# EAGLE design ADDINBRD2_V1 (EAGLE 7.7.0)

## Sheet 1 of 2
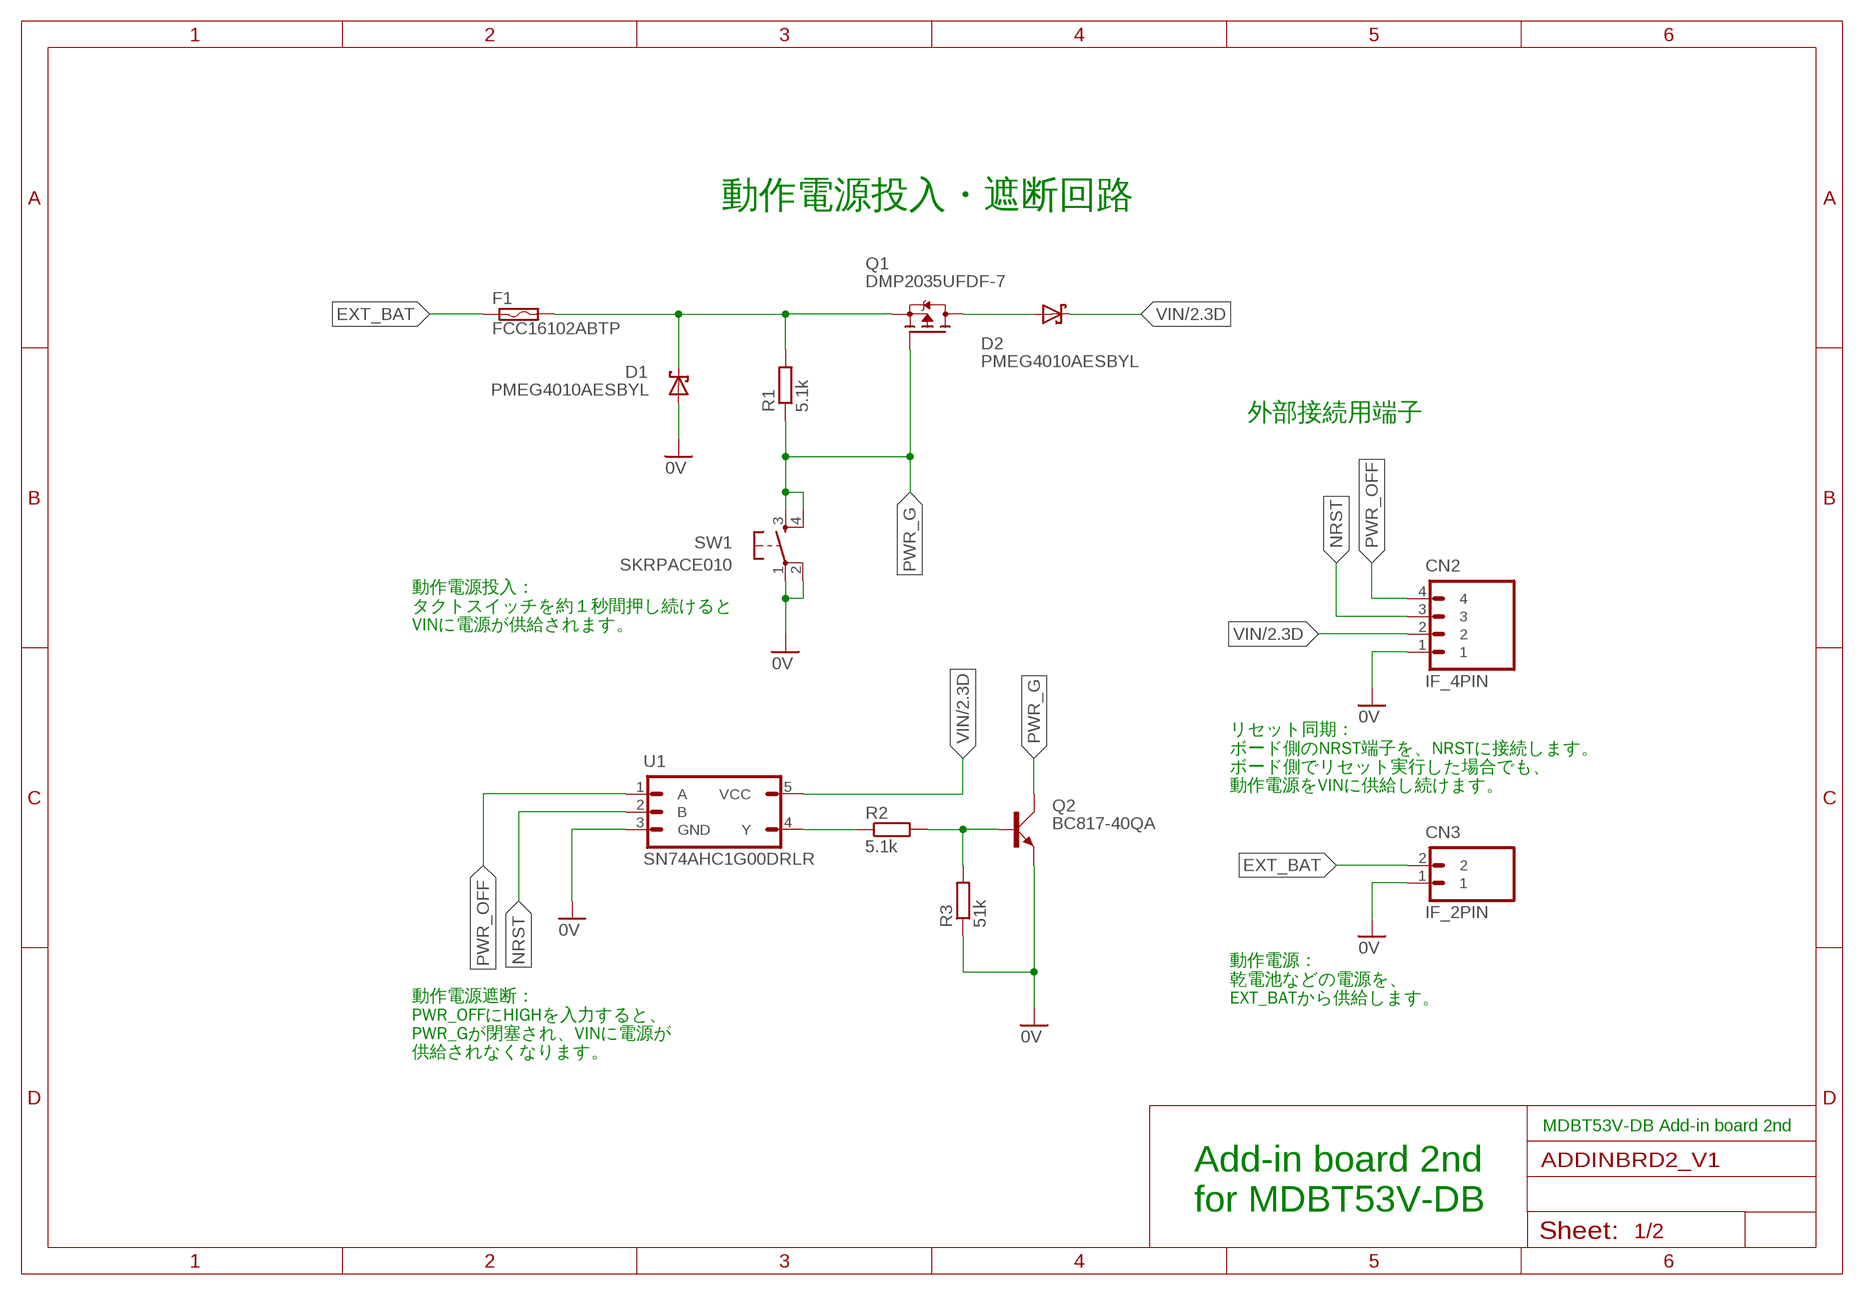
[diagram p0: schematic, sheet 1]

### Parts
CN2  IF_4PIN  [HEADER_4PIN]
CN3  IF_2PIN  [HEADER_2PIN]
D1  PMEG4010AESBYL  [DSN1006-2]
D2  PMEG4010AESBYL  [DSN1006-2]
F1  FCC16102ABTP  [FCC16]
Q1  DMP2035UFDF-7  [U-DFN2020-6]
Q2  BC817-40QA  [DFN1010D-3]
R1  5.1k  CRCW04025K10FKEDC  [R0402N]
R2  5.1k  CRCW04025K10FKEDC  [R0402N]
R3  51k  CRCW040251K0FKEDC  [R0402N]
SW1  SKRPACE010  [SKRPACE010]
U1  SN74AHC1G00DRLR  [DRL0005A]

### Nets
0V: CN2.1 CN3.1 D1.1(A) Q2.2(E) R3.1 SW1.1(P) SW1.2(P1) U1.3(GND) ; also sheet 2
EXT_BAT: CN3.2 F1.1
N$1: D1.2(C) F1.2 Q1.4(S) Q1.EXP2(S) R1.2
N$2: D2.1(A) Q1.1(D) Q1.2(D) Q1.5(D) Q1.6(D) Q1.EXP(D)
N$3: R2.1 U1.4(Y)
N$5: Q2.1(B) R2.2 R3.2
NRST: CN2.3 U1.2(B)
PWR_G: Q1.3(G) Q2.3(C) R1.1 SW1.3(S) SW1.4(S1)
PWR_OFF: CN2.4 U1.1(A)
VIN: CN2.2 D2.2(C) U1.5(VCC) ; also sheet 2

### Notes on the sheet
- 動作電源投入・遮断回路
- 外部接続用端子
- 動作電源投入：
  タクトスイッチを約１秒間押し続けると
  VINに電源が供給されます。
- リセット同期：
  ボード側のNRST端子を、NRSTに接続します。
  ボード側でリセット実行した場合でも、
  動作電源をVINに供給し続けます。
- 動作電源：
  乾電池などの電源を、
  EXT_BATから供給します。
- 動作電源遮断：
  PWR_OFFにHIGHを入力すると、
  PWR_Gが閉塞され、VINに電源が
  供給されなくなります。
- MDBT53V-DB Add-in board 2nd
- Add-in board 2nd
  for MDBT53V-DB

## Sheet 2 of 2
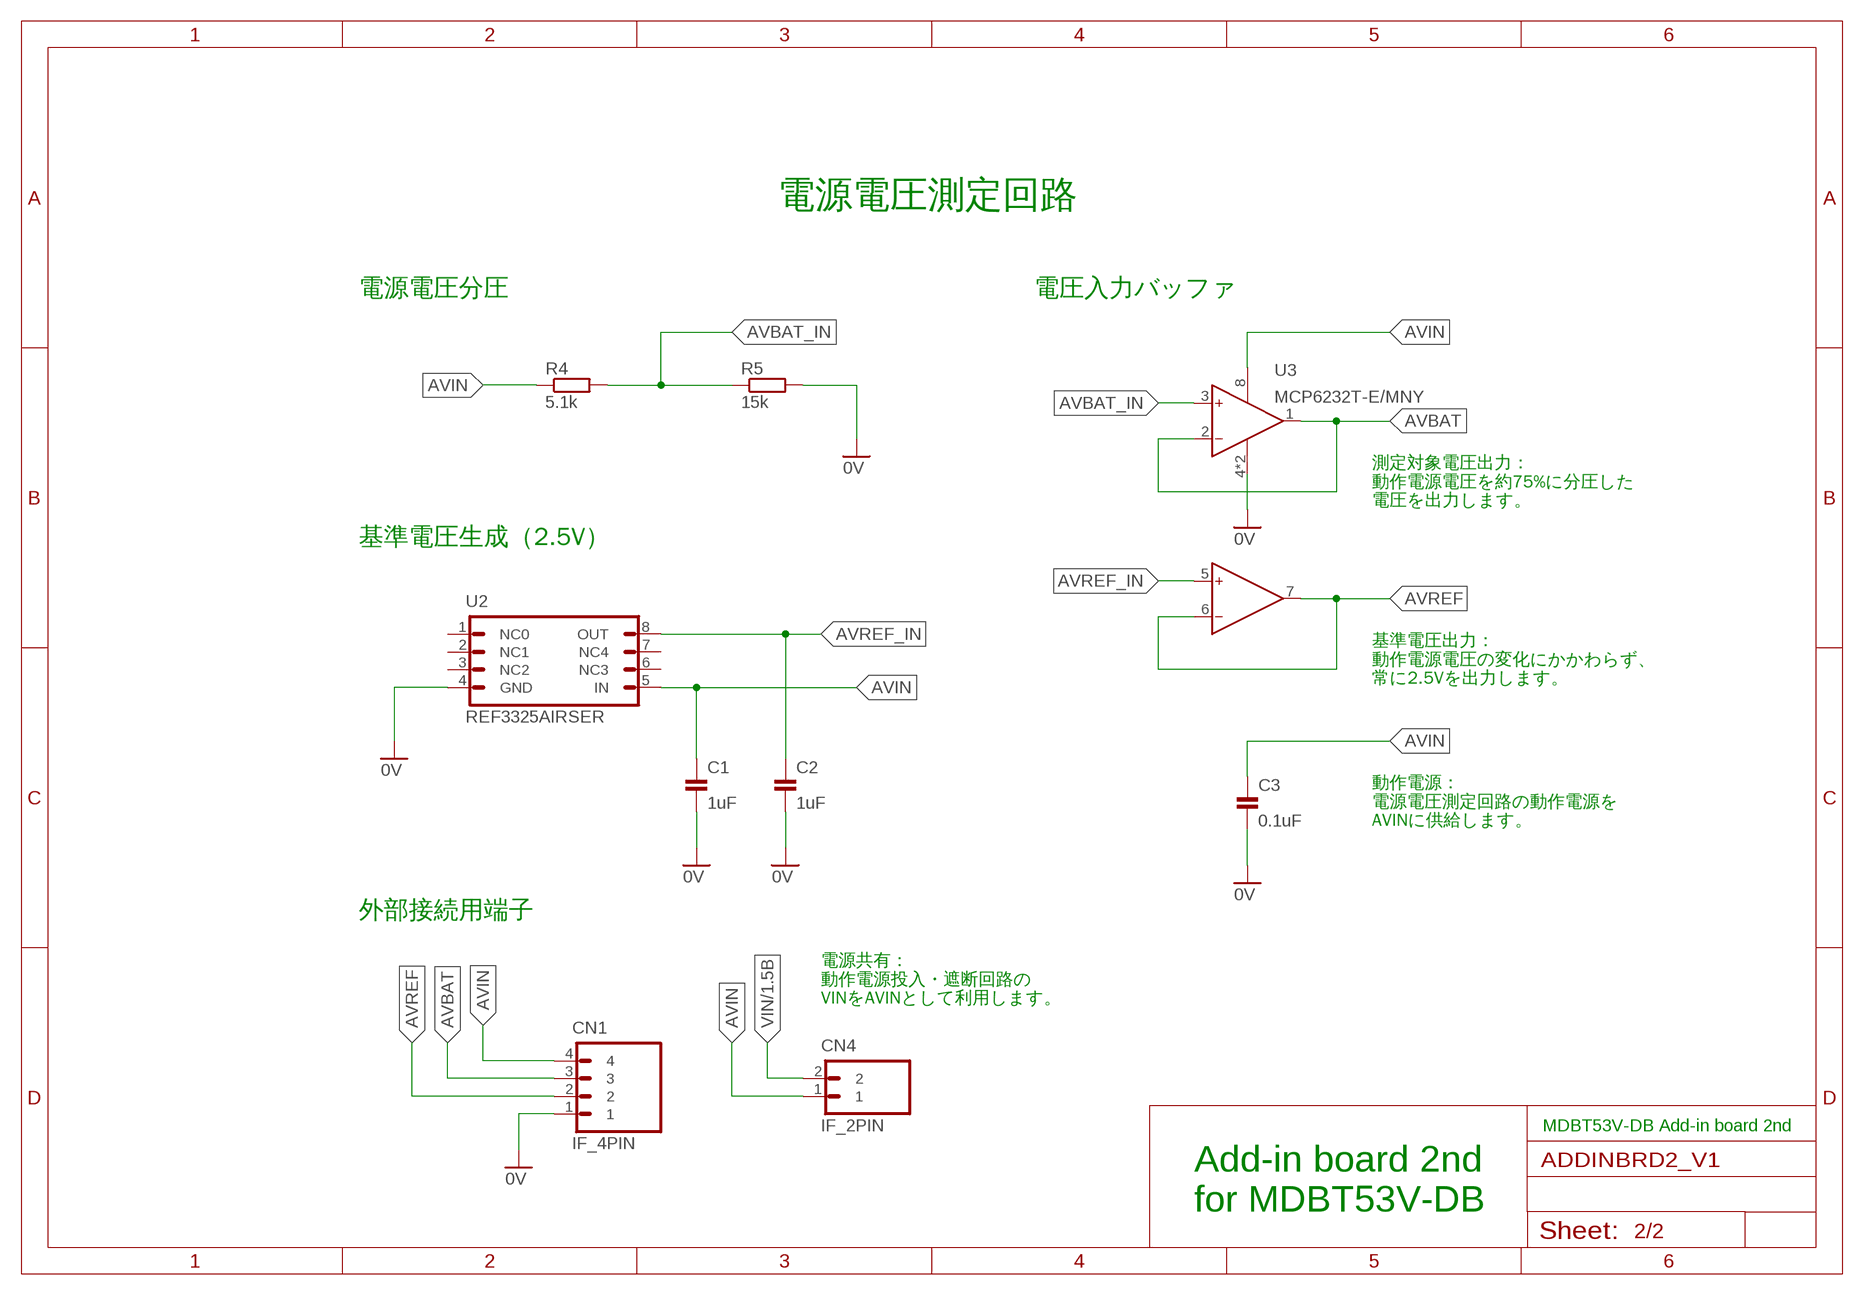
[diagram p1: schematic, sheet 2]

### Parts
C1  1uF  TMK105AC6105KV-F  [C0402]
C2  1uF  TMK105AC6105KV-F  [C0402]
C3  0.1uF  UMK105B7104KV-FR  [C0402]
CN1  IF_4PIN  [HEADER_4PIN]
CN4  IF_2PIN  [HEADER_2PIN]
R4  5.1k  ERA-2APB512X  [R0402N]
R5  15k  ERA-2APB153X  [R0402N]
U2  REF3325AIRSER  [RSE0008A]
U3  MCP6232T-E/MNY  [TDFN-2X3]

### Nets
0V: C1.2 C2.2 C3.2 CN1.1 R5.2 U2.4(GND) U3.4(VSS) U3.9(VSS) ; also sheet 1
AVBAT: CN1.3 U3.1(VOUTA) U3.2(VINA-)
AVBAT_IN: R4.2 R5.1 U3.3(VINA+)
AVIN: C1.1 C3.1 CN1.4 CN4.1 R4.1 U2.5(IN) U3.8(VDD)
AVREF: CN1.2 U3.6(VINB-) U3.7(VOUTB)
AVREF_IN: C2.1 U2.8(OUT) U3.5(VINB+)
VIN: CN4.2 ; also sheet 1
Unconnected: U2.1(NC0) U2.2(NC1) U2.3(NC2) U2.6(NC3) U2.7(NC4)

### Notes on the sheet
- 電源電圧測定回路
- 電源電圧分圧 | 電圧入力バッファ
- 測定対象電圧出力：
  動作電源電圧を約75%に分圧した
  電圧を出力します。
- 基準電圧生成（2.5V）
- 基準電圧出力：
  動作電源電圧の変化にかかわらず、
  常に2.5Vを出力します。
- 動作電源：
  電源電圧測定回路の動作電源を
  AVINに供給します。
- 外部接続用端子
- 電源共有：
  動作電源投入・遮断回路の
  VINをAVINとして利用します。
- MDBT53V-DB Add-in board 2nd
- Add-in board 2nd
  for MDBT53V-DB

## Library data of the parts
C1 C2 = SMDs:TMK105AC6: MLCC TAIYO YUDEN Multilayer Ceramic Capacitors
C3 = SMDs:UMK105B7: MLCC TAIYO YUDEN Multilayer Ceramic Capacitors
CN1 CN2 = Connectors:IF_4PIN: 4-pin インターフェース
CN3 CN4 = Connectors:IF_2PIN: 2-pin インターフェース
D1 D2 = SMDs:PMEG4010: Schottky Diode If - Forward Current: 1 A Vf - Forward Voltage: 435 mV Vr - Reverse Voltage: 40 V Ir - Reverse Current: 325 uA Minimum Operating Temperature: from -55C to +150C
F1 = SMDs:FCC16: Surface Mount Fuse 0603 Current Rating: 1 A Voltage Rating DC: 36 VDC Operating Temperature: from -55C to +125C Resistance: 130 mOhms
Q1 = SMDs:DMP2035: P-CHANNEL ENHANCEMENT MODE MOSFET Vds - Drain-Source Breakdown Voltage: 20 V Id - Continuous Drain Current: 6.9 A Rds On - Drain-Source Resistance: 120 mOhms Vgs th - Gate-Source Threshold Voltage: 1 V Operating Temperature: from - 55 C to + 150 C
Q2 = SMDs:BC817: NPN general-purpose transistor
R1-R3 = SMDs:CRCW0402: Chip resistor Vishay / Dale Thick Film Resistors
R4 R5 = SMDs:ERA-2A: Chip resistor Panasonic Thin Film Resistors
SW1 = Parts:SKRPACE010: 表面実装用タクトスイッチ ４．２×３．２ｍｍ小型重作動力タイプ ・作動力：２．５５Ｎ ・操作方向：垂直 ・移動量：０．２ｍｍ ・動作寿命：５０，０００ｃｙｃｌｅｓ （５ｍＡ ５ＶＤＣ） ・初期接触抵抗：最大５００ｍΩ
U1 = ICs:SN74AHC1G00: Single 2-Input Positive-NAND Gate Texas Instruments
U2 = ICs:REF33: Voltage Reference Output Voltage: 2.5 V Initial Accuracy: 0.15 % Temperature Coefficient: 30 PPM / C Series VREF - Input Voltage - Max: 5.5 V Operating Temperature: from- 40 C to + 125 C
U3 = ICs:MCP6232: Operational Amplifier Microchip 2 Channel Rail to Rail Operational Amplifier

## Board
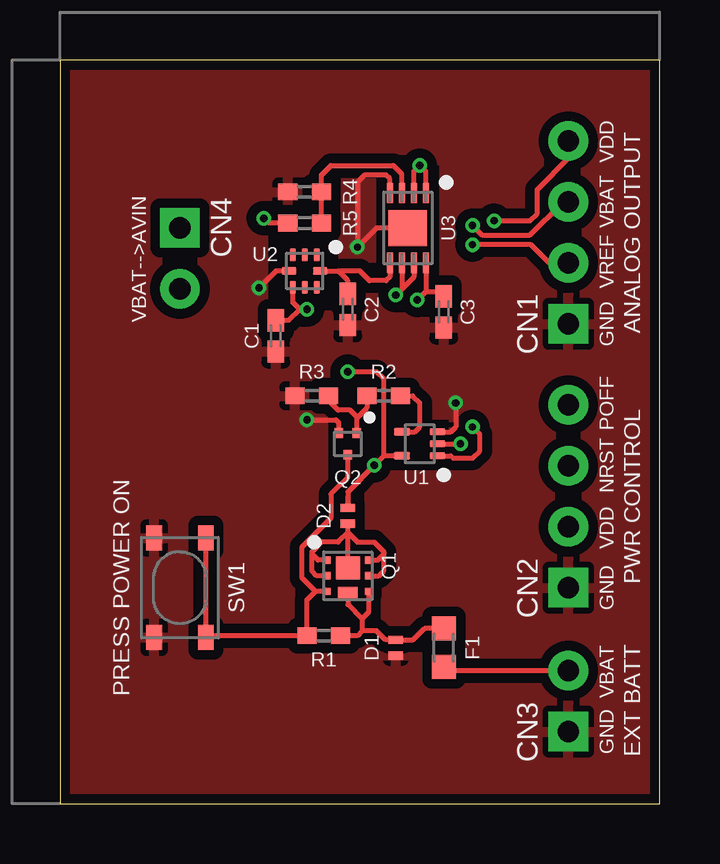
[diagram p2: board, top side]
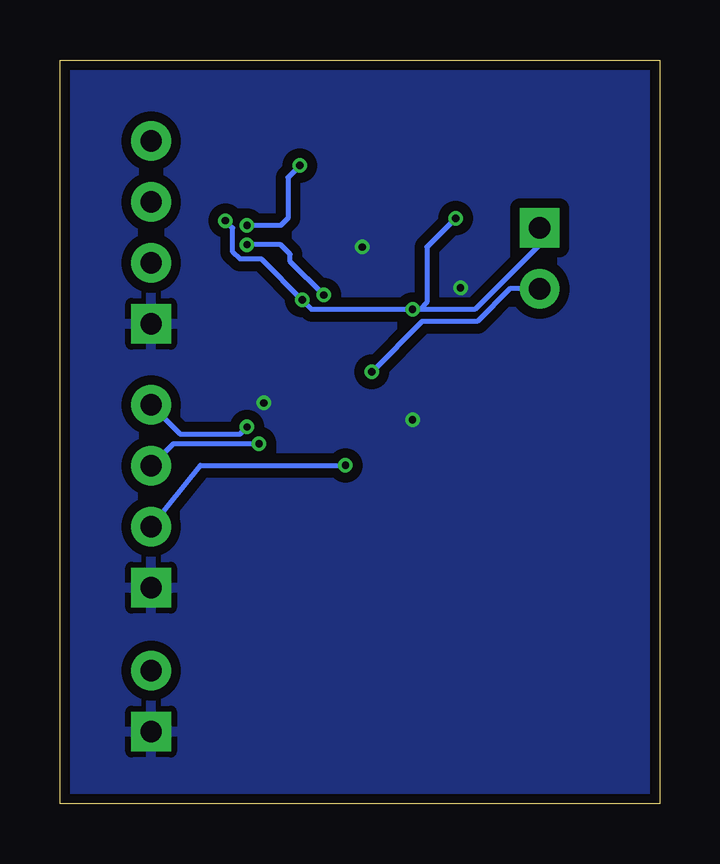
[diagram p3: board, bottom side, seen from below]

Size 25 x 31 mm. Coordinates in mm from the lower left corner, seen from the top.
Outline: 0,0 25,0 25,31 0,31 0,0
Copper layers (1*16): Top 0.035mm / dielectric 1.5mm / Bottom 0.035mm
Design rules "SeeedStudio_2layer_DRU_no_angle_20140221 *": minimum track width 6mil, minimum drill 0.3mm, track to track 6mil, track to pad 6mil, pad to pad 6mil, via to via 6mil, smd to smd 0mil, copper to edge 10mil, drill to drill 10mil, minimum pad ring 10mil, minimum via ring 6mil, stop-mask expansion 2mil, vias tented up to drill 100mil, thermal gap 10mil

### Footprints (pad centres in the part's own frame; a part is rotated, then mirrored left to right if it is on the bottom)
C0402 = smd 0.925 x 0.7: 1 -0.65,0; 2 0.65,0
HEADER_4PIN = drill 0.889 pad 1.651 square: 1 0,0 | drill 0.889 pad 1.651: 2 2.54,0; 3 5.08,0; 4 7.62,0
HEADER_2PIN = drill 0.889 pad 1.651 square: 1 0,0 | drill 0.889 pad 1.651: 2 2.54,0
DSN1006-2 = smd 0.35 x 0.6: 1 -0.325,0; 2 0.325,0
FCC16 = smd 1 x 1: 1 -0.8,0; 2 0.8,0
U-DFN2020-6 = smd 0.3 x 0.275: 1 -0.65,-0.863; 2 0,-0.863; 3 0.65,-0.863; 4 0.65,0.863; 5 0,0.863; 6 -0.65,0.863 | smd 0.95 x 1: EXP -0.325,0 | smd 0.48 x 0.8: EXP2 0.7,0
DFN1010D-3 = smd 0.35 x 0.4: 1 0.375,0.45; 2 -0.375,0.45; 3 0,-0.45
R0402N = smd 0.8 x 0.7: 1 -0.7,0; 2 0.7,0
SKRPACE010 = smd 1.05 x 0.65: 1 -2.075,1.075; 2 2.075,1.075; 3 -2.075,-1.075; 4 2.075,-1.075
DRL0005A = smd 0.67 x 0.28: 1 -0.74,0.5; 2 -0.74,0; 3 -0.74,-0.5 | smd 0.67 x 0.3: 4 0.74,-0.5; 5 0.74,0.5
RSE0008A = smd 0.55 x 0.25: 1 -0.675,0.5; 2 -0.675,0; 3 -0.675,-0.5; 5 0.675,-0.5; 6 0.675,0; 7 0.675,0.5 | smd 0.3 x 0.6: 4 0,-0.65; 8 0,0.65
TDFN-2X3 = smd 0.25 x 0.85: 1 -0.75,-1.45; 2 -0.25,-1.45; 3 0.25,-1.45; 4 0.75,-1.45; 5 0.75,1.45; 6 0.25,1.45; 7 -0.25,1.45; 8 -0.75,1.45 | smd 1.6 x 1.5: 9 0,0

### Placement (x,y rotation side)
C1  9,19.5 270 top
C2  12,20.6 270 top
C3  16,20.5 270 top
CN1  21.2,20 90 top
CN2  21.2,9 90 top
CN3  21.2,3 90 top
CN4  5,24 270 top
D1  14,6.5 90 top
D2  12,12 90 top
F1  16,6.5 90 top
Q1  12,9.5 270 top
Q2  12,15 0 top
R1  11,7 0 top
R2  13.5,17 180 top
R3  10.5,17 0 top
R4  10.2,24.2 0 top
R5  10.2,25.5 180 top
SW1  5,9 90 top
U1  15,15 180 top
U2  10.2,22.2 270 top
U3  14.5,24 180 top

### Tracks (layer width: path | path; a pad name or v marks a point on that pad's centre or on a via)
0V  (via drill 0.3)
  Top 0.203: U1.3 16.3,15.5 16.5,15.7 v16.5,16.7 | Q2.2 11.62,15.88 11.5,16 v10.3,16 | U2.4 9,22.2 v8.3,21.5 | U3.9 13.2,24 v12.4,23.2 12.4,25.9 12.7,26.2 13.6,26.2 13.75,26.05 U3.4
  pour Top (isolate 0.406, rank 3): -0.5,-0.5 25.5,-0.5 25.5,31.5 -0.5,31.5
  pour Bottom (isolate 0.406, rank 3): -1,-1 26,-1 26,32 -1,32
AVBAT  (via drill 0.3)
  Top 0.203: U3.1 15.25,26.35 v15,26.6 14.75,26.35 U3.2 | v17.2,24.1 17.6,23.7 19.6,23.7 20.98,25.08 CN1.3
  Bottom 0.203: v15,26.6 15.5,26.1 15.5,24.4 15.8,24.1 v17.2,24.1
AVBAT_IN
  Top 0.203: R4.2 R5.1 10.9,26.2 11.3,26.6 13.9,26.6 14.25,26.25 U3.3
AVIN  (via drill 0.3)
  Top 0.203: 10,20.6 9.7,20.9 U2.5 | v10.3,20.6 10,20.6 | 10,20.6 9.55,20.15 C1.1 | R4.1 8.7,24.2 v8.5,24.4 | U3.8 15.25,21.35 | 15.25,21.35 v14.9,21 | 15.25,21.35 15.8,21.35 C3.1 | CN1.4 21.2,26.9 19.9,25.6 19.9,24.6 19.6,24.3 v18.1,24.3
  Bottom 0.203: CN4.1 5,23.3 7.7,20.6 v10.3,20.6 | v8.5,24.4 9.7,23.2 9.7,20.9 10,20.6 v10.3,20.6 | v10.3,20.6 14.5,20.6 v14.9,21 16.6,22.7 17.5,22.7 17.8,23 17.8,24 v18.1,24.3
AVREF  (via drill 0.3)
  Top 0.203: U3.6 14.25,21.45 v14,21.2 14.75,21.95 U3.7 | v17.2,23.3 19.64,23.3 20.4,22.54 CN1.2
  Bottom 0.203: v14,21.2 15.4,22.6 15.4,22.9 15.8,23.3 v17.2,23.3
AVREF_IN
  Top 0.203: U2.8 11.6,22.2 11.65,22.15 | C2.1 12,21.8 11.65,22.15 | U3.5 13.75,21.95 13.6,21.8 12.9,21.8 12.5,22.2 11.7,22.2 11.65,22.15
EXT_BAT
  Top 0.203: 16.3,5.4 F1.1 16.16,5.54 CN3.2
N$1
  Top 0.203: F1.2 15.2,7.3 14.72,6.83 D1.2 13.57,6.83 13.2,7.2 12.6,7.2 | Q1.EXP2 12,8.3 12.6,7.7 | 12.6,7.2 12.4,7 R1.2 | 12.6,7.7 12.6,7.2 | Q1.4 12.86,7.96 12.6,7.7
N$2
  Top 0.203: Q1.6 13.25,10.15 13.5,10.4 | Q1.5 13.3,9.5 13.5,9.7 13.5,10.4 | Q1.2 10.7,9.5 10.5,9.7 10.5,10.4 | Q1.1 10.75,10.15 10.5,10.4 | 12,11.3 12.4,10.9 13.1,10.9 13.5,10.5 13.5,10.4 | 12,11.3 11.6,10.9 10.9,10.9 10.5,10.5 10.5,10.4 | 12,11.3 D2.1 Q1.EXP
N$3
  Top 0.203: U1.4 14.8,15.5 15,15.7 15,16.7 14.7,17 R2.1
N$4
  cutout Top (isolate 0.203): 13.8,16 16.2,16 16.2,13.9 13.8,13.9
  cutout Top (isolate 0.203): 11.2,16.2 12.8,16.2 12.8,13.5 11.2,13.5
  cutout Top (isolate 0.203): 8.7,23.7 11.6,23.7 11.6,21 8.7,21
  cutout Top (isolate 0.203): 13.2,26.6 15.8,26.6 15.8,22 13.2,22
N$5
  Top 0.203: Q2.1 12.38,16.07 | 12.38,16.07 12.8,16.5 R2.2 | 12.38,16.07 12.38,16.12 12.1,16.4 11.6,16.4 11.2,16.8 R3.2
NRST  (via drill 0.3)
  Top 0.203: U1.2 v16.7,15
  Bottom 0.203: v16.7,15 20.28,15 CN2.3
PWR_G
  Top 0.203: SW1.4 SW1.3 6.15,7 R1.1 10.3,8.5 10.65,8.85 | Q1.3 10.65,8.85 | 10.65,8.85 10.1,9.4 10.1,10.7 11.3,11.9 11.3,12.9 12,13.6 Q2.3
PWR_OFF  (via drill 0.3)
  Top 0.203: U1.1 16.3,14.5 16.4,14.4 17.2,14.4 17.5,14.7 17.5,15.4 v17.2,15.7
  Bottom 0.203: CN2.4 19.98,15.4 17.5,15.4 v17.2,15.7
VIN  (via drill 0.3)
  Top 0.203: U1.5 13.5,14.5 | 13.5,14.5 v13.1,14.1 12,13 D2.2 12,12.8 | 13.5,14.5 13.5,17.7 13.2,18 v12,18
  Bottom 0.203: CN2.2 19.14,14.1 v13.1,14.1 | CN4.2 6.24,21.46 7.6,20.1 9.9,20.1 v12,18

### Text on the board
tPlace: VDD | VBAT | ANALOG OUTPUT | VBAT-->AVIN | VREF | GND | POFF | NRST | PWR CONTROL | VDD | PRESS POWER ON | GND | VBAT | EXT BATT | GND